# Altium schematic sheet Driver_motor.SchDoc
size A3
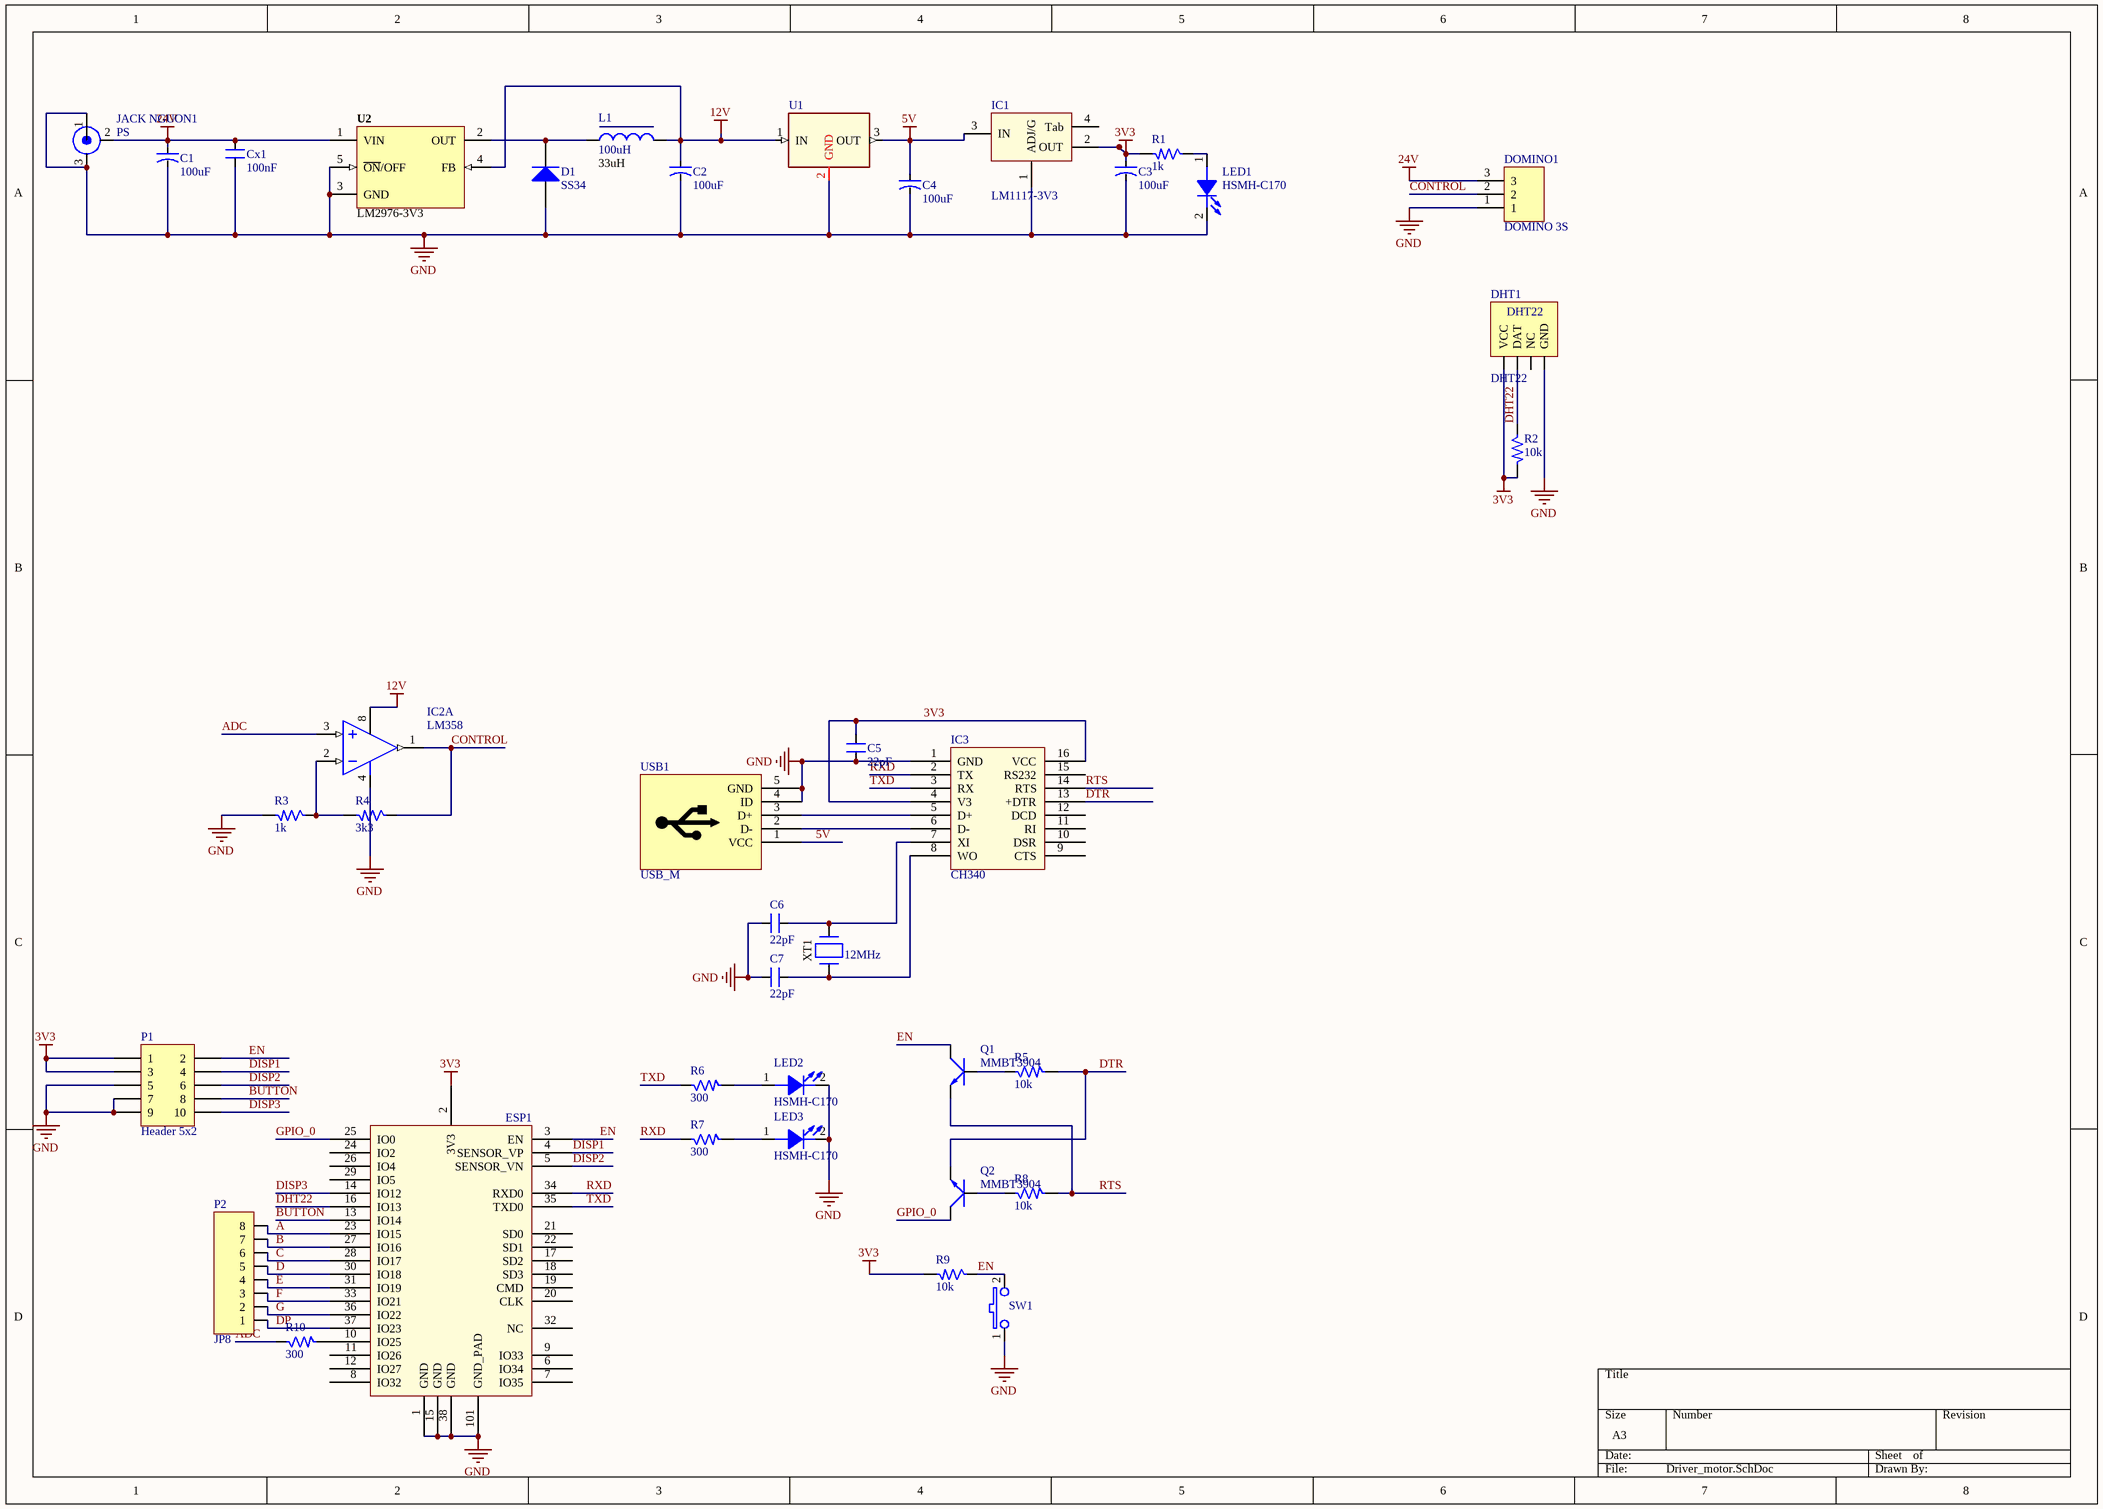
[diagram p0: Driver_motor.SchDoc]

## Parts
C1  100uF  [CAP-ALU-SMD-D]
C2  100uF  [CAP-ALU-SMD-D]
C3  100uF  [CAP-ALU-SMD-D]
C4  100uF  [CAP-ALU-SMD-D]
C5  22pF  [SM-CAP-0805]
C6  22pF  [SM-CAP-0805]
C7  22pF  [SM-CAP-0805]
Cx1  100nF  [CN-SMD-1206]
D1  SS34  [DIOT]
DHT1  DHT22  [DHT22]
DOMINO1  DOMINO 3S  [DOMINO 3S]
ESP1  ESP32S_Module  [ESP32]  (value not drawn)
IC1  LM1117-3V3  [LM1117-3V3-5V]
IC2  LM358  [SO8]  (part A of 2)
IC3  CH340  [ch340 g]
JACK_NGUON1  PS  [jack nguon]
L1  100uH  value 33uH  [cuon cam]
LED1  HSMH-C170  [LED]
LED2  HSMH-C170  [LED.SMD.GREEN]
LED3  HSMH-C170  [LED.SMD.GREEN]
P1  Header 5x2  [Header 5x2]
P2  JP8  [JP8-C1T]
Q1  MMBT3904  [MMBT 3904]
Q2  MMBT3904  [MMBT 3904]
R1  1k  [SM-RES-0805]
R2  10k  [SM-RES-0805]
R3  1k  [SM-RES-0805]
R4  3k3  [SM-RES-0805]
R5  10k  [SM-RES-0805]
R6  300  [SM-RES-0805]
R7  300  [SM-RES-0805]
R8  10k  [SM-RES-0805]
R9  10k  [SM-RES-0805]
R10  300  [SM-RES-0805]
SW1  PTS635  [BUTTON SMD 2PIN]  (value not drawn)
U1  LM78xx  [TO-263]  (value not drawn)
U2  LM2976-3V3  [TO263]
USB1  USB_M  [micro usb]
XT1  value 12MHz  [Crystal.HC49_N]  (hidden comment: Crystal2)

## Nets
3V3: C3.1 C5.2 DHT1.1(VCC) ESP1.2(3V3) IC1.2(OUT) IC3.4(V3) IC3.16(VCC) P1.1 P1.3 R1.2 R2.2 R9.2
5V: C4.1 IC1.3(IN) U1.3(OUT) USB1.1(VCC)
12V: C2.1 IC2.8(+V) L1.2 U1.1(IN) U2.4(FB)
24V: C1.1 Cx1.2 DOMINO1.3 JACK_NGUON1.2(SHIELD) U2.1(VIN)
GND: C1.2 C2.2 C3.2 C4.2 C5.1 C6.1 C7.1 Cx1.1 D1.1(A) DHT1.4(GND) DOMINO1.1 ESP1.1(GND) ESP1.15(GND) ESP1.38(GND) ESP1.101(GND_PAD) IC1.1(ADJ/G) IC2.4(-V) IC3.1(GND) JACK_NGUON1.1(CENTER) JACK_NGUON1.3(SHIELD) LED1.2(K) LED2.2(K) LED3.2(K) P1.5 P1.7 P1.9 R3.2 SW1.1 U1.2(GND) U2.3(GND) U2.5(~{ON}/OFF) USB1.4(ID) USB1.5(GND)
A: ESP1.23(IO15) P2.8
ADC: IC2.3(IN+) R10.1
B: ESP1.27(IO16) P2.7
BUTTON: ESP1.13(IO14) P1.8
C: ESP1.28(IO17) P2.6
CONTROL: DOMINO1.2 IC2.1(OUT) R4.1
D: ESP1.30(IO18) P2.5
DHT22: DHT1.2(DAT) ESP1.16(IO13) R2.1
DISP1: ESP1.4(SENSOR_VP) P1.4
DISP2: ESP1.5(SENSOR_VN) P1.6
DISP3: ESP1.14(IO12) P1.10
DP: ESP1.37(IO23) P2.1
DTR: IC3.13(+DTR) Q2.2(E) R5.2
E: ESP1.31(IO19) P2.4
EN: ESP1.3(EN) P1.2 Q1.3(C) R9.1 SW1.2
F: ESP1.33(IO21) P2.3
G: ESP1.36(IO22) P2.2
GPIO_0: ESP1.25(IO0) Q2.3(C)
RTS: IC3.14(RTS) Q1.2(E) R8.2
RXD: ESP1.34(RXD0) IC3.2(TX) R7.1
TXD: ESP1.35(TXD0) IC3.3(RX) R6.1
NetC6_2: C6.2 IC3.7(XI) XT1.2
NetC7_2: C7.2 IC3.8(WO) XT1.1
NetD1_2: D1.2(K) L1.1 U2.2(OUT)
NetESP1_10: ESP1.10(IO25) R10.2
NetIC2_2: IC2.2(IN-) R3.1 R4.2
NetIC3_5: IC3.5(D+) USB1.3(D+)
NetIC3_6: IC3.6(D-) USB1.2(D-)
NetLED1_1: LED1.1(A) R1.1
NetLED2_1: LED2.1(A) R6.2
NetLED3_1: LED3.1(A) R7.2
NetQ1_1: Q1.1(B) R5.1
NetQ2_1: Q2.1(B) R8.1

Not connected (* = marked no-connect by the designer): DHT1 3(NC); ESP1 6(IO34) 7(IO35) 8(IO32) 9(IO33) 11(IO26) 12(IO27) 17(SD2) 18(SD3) 19(CMD) 20(CLK) 21(SD0) 22(SD1) 24(IO2) 26(IO4) 29(IO5) 32(NC); IC1 4(Tab); IC3 9(CTS) 10(DSR) 11(RI) 12(DCD) 15(RS232)

## Library data of the parts
C1-C4 = CN-ALU-SMD: Polarized Capacitor (Axial); Published: 8-Jun-2000; LatestRevisionDate: 17-Jul-2002; LatestRevisionNote: Re-released for DXP Platform.; PackageReference: POLAR0.8; Publisher: Altium Limited
C5-C7 = CN: 0,1uF/300V; Designed by: VanDungEvn; Value: 0,1uF/300V
Cx1 = CN: Value: 33pF
D1 = Diode 1N4007: 1 Amp General Purpose Rectifier; Published: 8-Jun-2000; LatestRevisionDate: 17-Jul-2002; LatestRevisionNote: Re-released for DXP Platform.; DatasheetVersion: 1998; PackageVersion: Aug-1999; PackageReference: DO-41; Publisher: Altium Limited; PackageDescription: Diode, Axial; Body 5.2 x 2.7 mm (LxDia. max), Lead Dia. 0.86 mm (max); Code_JEDEC: DO-204-AL; ComponentLink1Description: Manufacturer Link; ComponentLink1URL: http://www.fairchildsemi.com/; ComponentLink2Description: Datasheet; ComponentLink2URL: http://www.fairchildsemi.com/ds/1N%2F1N4001.pdf
DHT1 = DHT22: Manufacturer: W¨¹rth Elektronik eiSos GmbH; partNo: 613004143121; ComponentLink1 Description: Manufacturer; ComponentLink2 Description: Datasheet; NoPins: 04; Created Date: 29 March 2013; ComponentLink1URL: http://www.we-online.com; ComponentLink2URL: http://katalog.we-online.de/em/datasheet/6130xx143121.pdf; Created by: Karrer Zheng
ESP1 = ESP32S_Module: Esp-32S; Datasheet: https://espressif.com/sites/default/files/documentation/esp_wroom_32_datasheet_en.pdf
IC1 = LM1117: 3v3; Value: LM317
IC2 = LM358: Low-Power Dual Operational Amplifier; Value: LM358
JACK_NGUON1 = JACK_DC: DC Power Jack, 2.5mm, KLD Series, PCB Mount; Vendor: Nhat Tao; ComponentLink1Description: Digikey Part link; ComponentLink2Description: Open DataSheet; ComponentLink2URL: H:\LIBRARY\LIBRARY.Datasheet\; Price: 1.500VND
L1 = Inductor Ferrite: Cuon Cam L; Code_IEC: 1005; Vendor: Digikey; Published: 8-Jun-2000; LatestRevisionDate: 17-Jul-2002; LatestRevisionNote: Re-released for DXP Platform.; PackageReference: 0402-A; Publisher: Altium Limited; Code_JEITA: 0402; ComponentLink1Description: Digikey Part Link; ComponentLink2Description: Open Datasheet; ComponentLink2URL: H:\LIBRARY\LIBRARY.Datasheet\
LED1-LED3 = LED_1: Typical GaAs SMD LED; Manufacturer: Lite-On Inc; Color: RED; Type: Cong ty RP; Vendor: Digikey; Publisher: Hoang Nguyen; Price: *; Published: 13-April-2009; ComponentLink1Description: Digikey Part Link; ComponentLink2Description: Open Datasheet; ComponentLink2URL: H:\LIBRARY\LIBRARY.Datasheet\
P1 = Header 5x2: Header, 10-Pin, 2-Row; LatestRevisionDate: 17-Jul-2002; LatestRevisionNote: Re-released for DXP Platform.; Publisher: Altium Limited
P2 = JP8: WR-PHD 2.54 mm Angled Socket Header; Manufacturer: W¨¹rth Elektronik eiSos GmbH; partNo: 613008143121; ComponentLink1 Description: Manufacturer; ComponentLink2 Description: Datasheet; NoPins: 08; Created Date: 29 March 2013; ComponentLink1URL: http://www.we-online.com; ComponentLink2URL: http://katalog.we-online.de/em/datasheet/6130xx143121.pdf; Created by: Karrer Zheng
R1-R10 = R_1: Resistor 1/4W; Value: R1/4W - 1K
SW1 = BUTTON SMD 2PIN: Manufacturer: C&K Components; Manufacturer P/N: PTS635SL25SMTR LFS; Vendor: Digikey; Vendor P/N: CKN9119CT-ND; ComponentLink1URL: http://search.digikey.com/scripts/DkSearch/dksus.dll?Detail&name=CKN1573CT-ND; ComponentLink2URL: H:\LIBRARY\LIBRARY.Datasheet\SBLCDA4_Specification.pdf; ComponentLink1Description: Digikey Part Link; ComponentLink2Description: Open Datasheet; Publisher: Hoang Nguyen; Published: 13-April-2009
U1 = LM78xx: Regulator; Manufacturer: Fairchild Semiconductor Corporation; PSpiceTemplate: X^@REFDES %IN %OUT %GND @MODEL; Vendor: Digikey; Output Current: Up to 1A; V out: 5V; Tolerance: 4 %; Value: LM7805CT; Published: 13-April-2009; Publisher: Hoang Nguyen; ComponentLink1Description: Digikey Part Link; ComponentLink2Description: Open Datasheet; ComponentLink2URL: H:\LIBRARY\LIBRARY.Datasheet\LM7805.pdf; Price: 2500 VND
U2 = LM2596: Max Input Voltage: 12 V; Max Output Current: 3 (6.0 peak) A; Max Output Voltage: mV; Category: IC-Power; Min Input Voltage: mV; Min Output Voltage: mV; Mounting Technology: Surface Mount; Status: Unreleased; Supply Voltage: mV; Temperature Range: -40 to +125 degC
XT1 = Crystal2: Quarz Crystal; Vendor: Digikey; Published: 13-April-2009; Publisher: Hoang Nguyen; ComponentLink1Description: Digikey Part Link; ComponentLink2Description: Open Datasheet; ComponentLink2URL: H:\LIBRARY\LIBRARY.Datasheet\; Price: 2000 VND